# EAGLE design BrushlessDCMotorController (EAGLE 6.5.0)
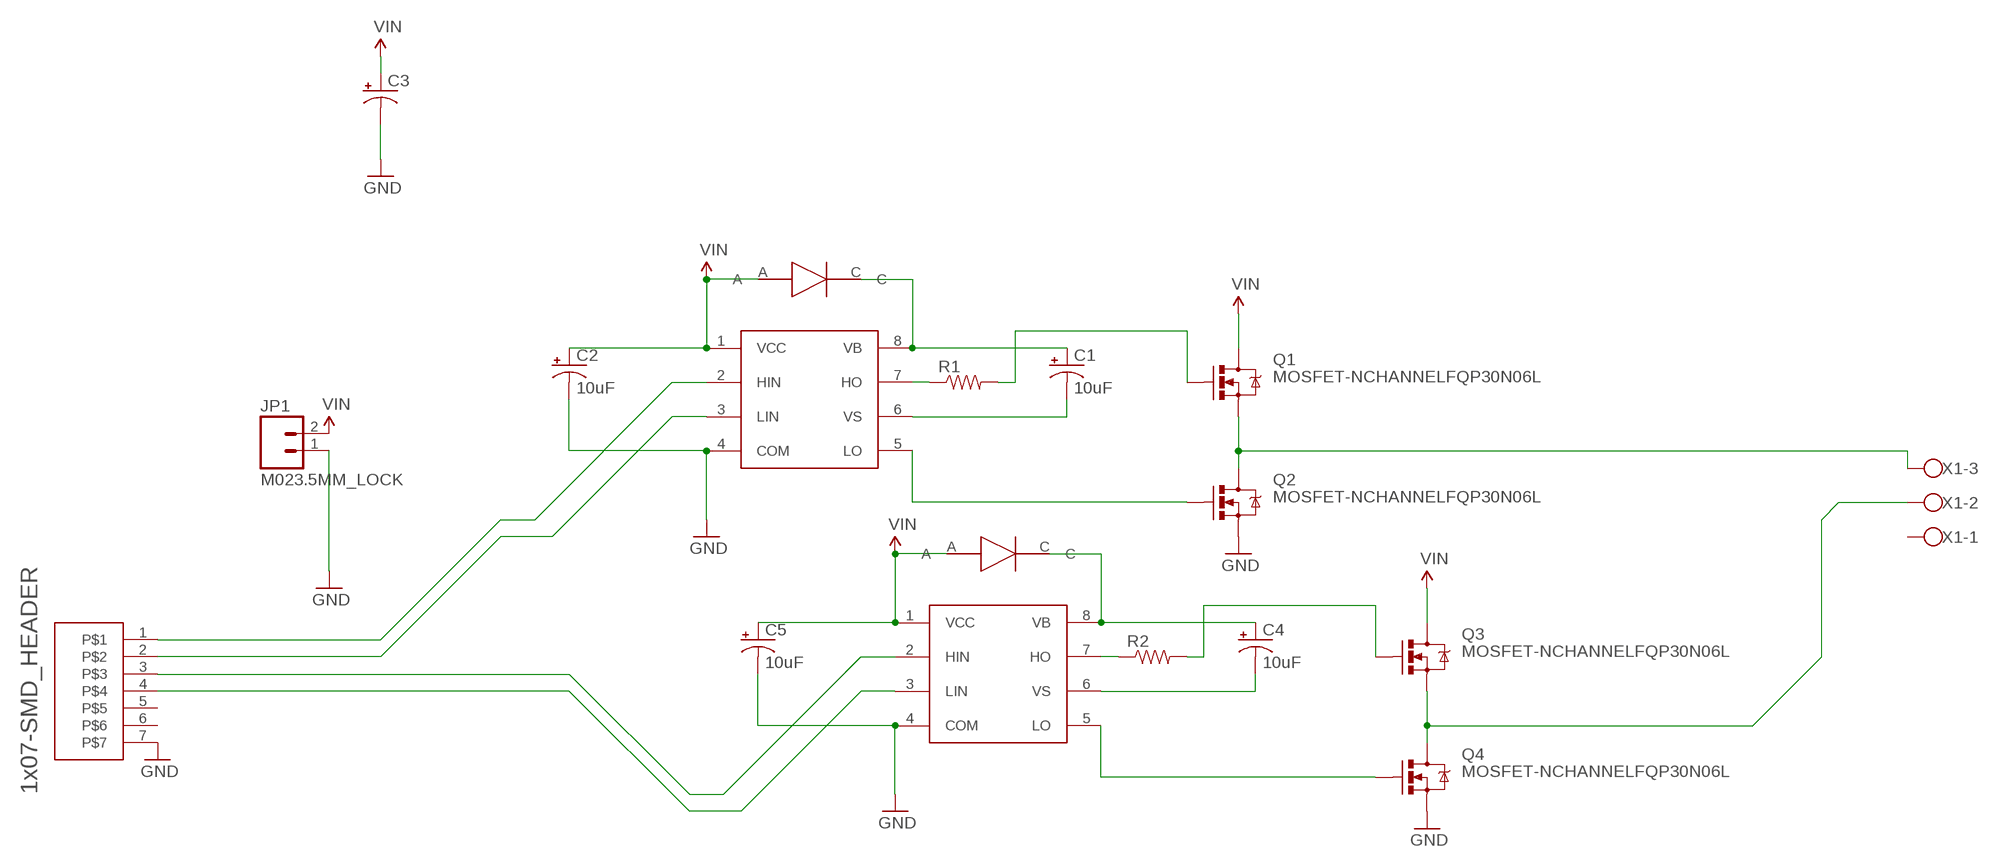
[diagram p0: schematic, sheet 1]

## Parts
C1  10uF  10UF-16V-10%(TANT)  [EIA3216]
C2  10uF  10UF-16V-10%(TANT)  [EIA3216]
C3  CAP_POLD  [PANASONIC_D]
C4  10uF  10UF-16V-10%(TANT)  [EIA3216]
C5  10uF  10UF-16V-10%(TANT)  [EIA3216]
JP1  M023.5MM_LOCK  [SCREWTERMINAL-3.5MM-2_LOCK]
Q1  MOSFET-NCHANNELFQP30N06L  [TO220V]
Q2  MOSFET-NCHANNELFQP30N06L  [TO220V]
Q3  MOSFET-NCHANNELFQP30N06L  [TO220V]
Q4  MOSFET-NCHANNELFQP30N06L  [TO220V]
R1  RESISTOR0805-RES  [0805]
R2  RESISTOR0805-RES  [0805]
U$1  IR2101  [SO08]
U$2  DFLS1150  [2SMD_FLAT_LEAD]
U$3  1X07-SMD_HEADER  [1X07-SMD_HEADER]
U$4  IR2101  [SO08]
U$5  DFLS1150  [2SMD_FLAT_LEAD]
X1  W239-103  [W239-103]

## Nets
GND: C2.C(-) C3.- C5.C(-) JP1.1 Q2.3(S) Q4.3(S) U$1.4(COM) U$3.7 U$4.4(COM)
N$1: C1.A(+) U$1.8(VB) U$2.C
N$2: C1.C(-) U$1.6(VS)
N$3: Q2.1(G) U$1.5(LO)
N$4: U$1.2(HIN) U$3.1
N$5: R1.1 U$1.7(HO)
N$6: Q1.1(G) R1.2
N$7: Q1.3(S) Q2.2(D) X1.3
N$8: U$1.3(LIN) U$3.2
N$9: C4.A(+) U$4.8(VB) U$5.C
N$10: C4.C(-) U$4.6(VS)
N$11: R2.1 U$4.7(HO)
N$12: Q3.1(G) R2.2
N$13: Q3.3(S) Q4.2(D) X1.2
N$14: Q4.1(G) U$4.5(LO)
N$15: U$3.3 U$4.2(HIN)
N$16: U$3.4 U$4.3(LIN)
VIN: C2.A(+) C3.+ C5.A(+) JP1.2 Q1.2(D) Q3.2(D) U$1.1(VCC) U$2.A U$4.1(VCC) U$5.A
Unconnected: U$3.5 U$3.6 X1.1

## Library data of the parts
C1 C2 C4 C5 = SparkFun-Capacitors:10UF-16V-10%(TANT): CAP-00811 1206/EIA-3216 Tantalum capacitor; PROD_ID: CAP-00811
C3 = SparkFun-Capacitors:CAP_POL: Capacitor Polarized These are standard SMD and PTH capacitors. Normally 10uF, 47uF, and 100uF in electrolytic and tantalum varieties. Always verify the external diameter of the through hole cap, it varies with capacity, voltage, and manufacturer. The EIA devices should be standard.
JP1 = SparkFun-Connectors:M02: Standard 2-pin 0.1" header. Use with - straight break away headers ( PRT-00116) - right angle break away headers (PRT-00553) - swiss pins (PRT-00743) - machine pins (PRT-00117) - female headers (PRT-00115) Molex polarized connector foot print use with: PRT-08233 with associated crimp pins and housings. 2.54_SCREWTERM for use with PRT-10571. 3.5mm Screw Terminal footprints for PRT-08084 5mm Screw Terminal footprints for use with PRT-08433
Q1-Q4 = SparkFun-DiscreteSemi:MOSFET-NCHANNEL: Common NMOSFET Parts MFG P/N Store ID Prod ID FDD8780 TRANS-09984 SI7820DN TRANS-11055 FDS6630A IC-08089 2N7002PW TRANS-11151 FQP30N06L COM-10213 TRANS-10060 BSS123LT1G TRANS-08345 BSS138 TRANS-00830 BS170 2N7000; PROD_ID: TRANS-10060
R1 R2 = SparkFun-Passives:RESISTOR: Resistor Basic schematic elements and footprints for 0603, 1206, and PTH resistors.
U$1 U$4 = hmcfabstudio:IR2101
U$2 U$5 = hmcfabstudio:DFLS1150: Digkey: DFLS1150DICT-ND Datasheet <http://www.diodes.com/datasheets/ds30593.pdf> 1.0A HIGH VOLTAGE SCHOTTKY BARRIER RECTIFIER (diode) V_f = 0.82 [v] V_reverse = 150 [v]
U$3 = hmcfabstudio:1X07-SMD_HEADER
X1 = con-wago-500:W239-103: WAGO SCREW CLAMP; MPN: 239-103; OC_FARNELL: unknown; OC_NEWARK: 33M7170

## Board
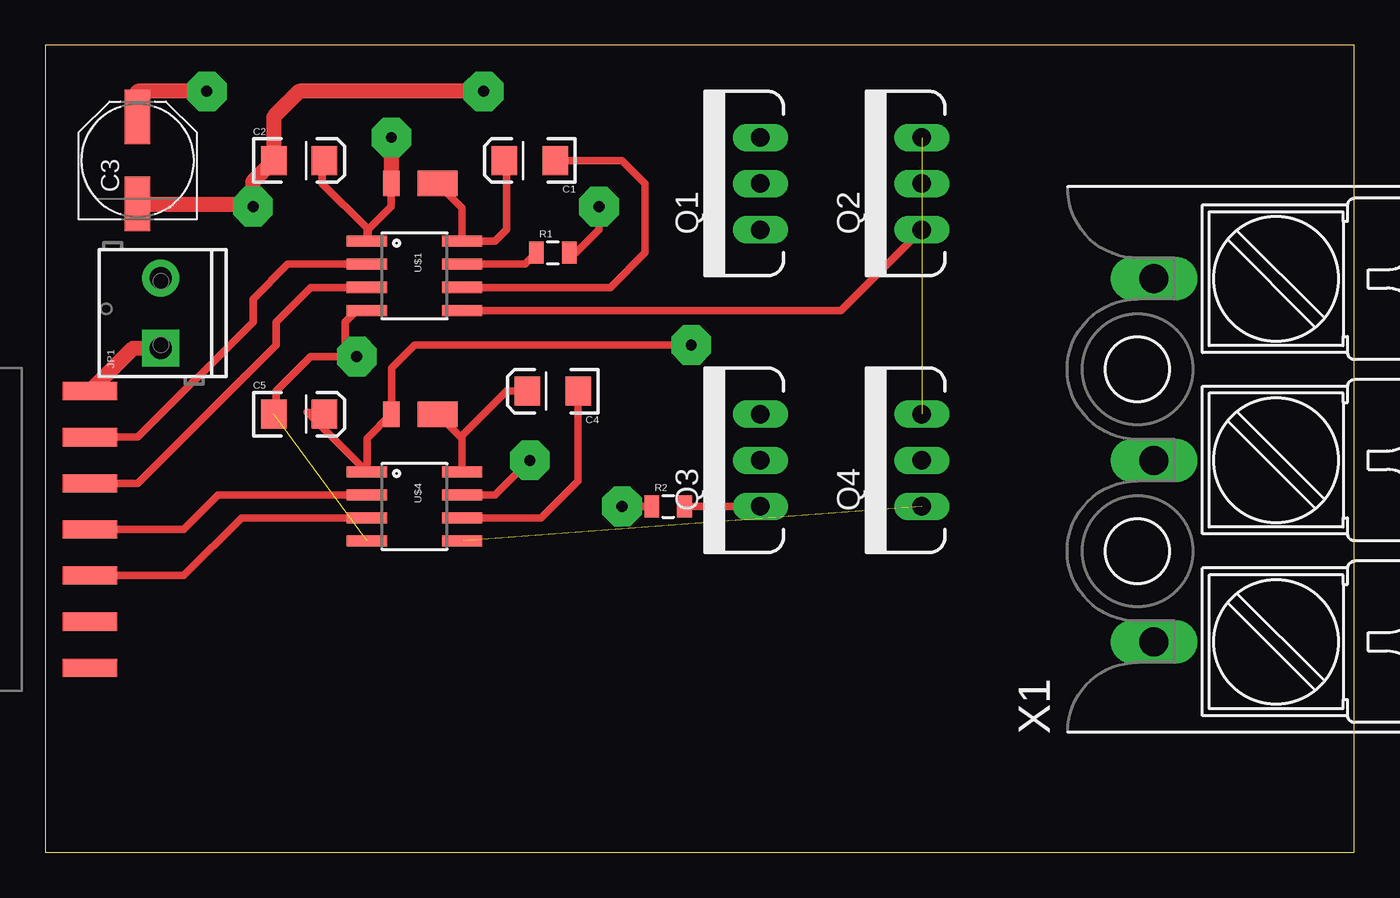
[diagram p1: board, top side]
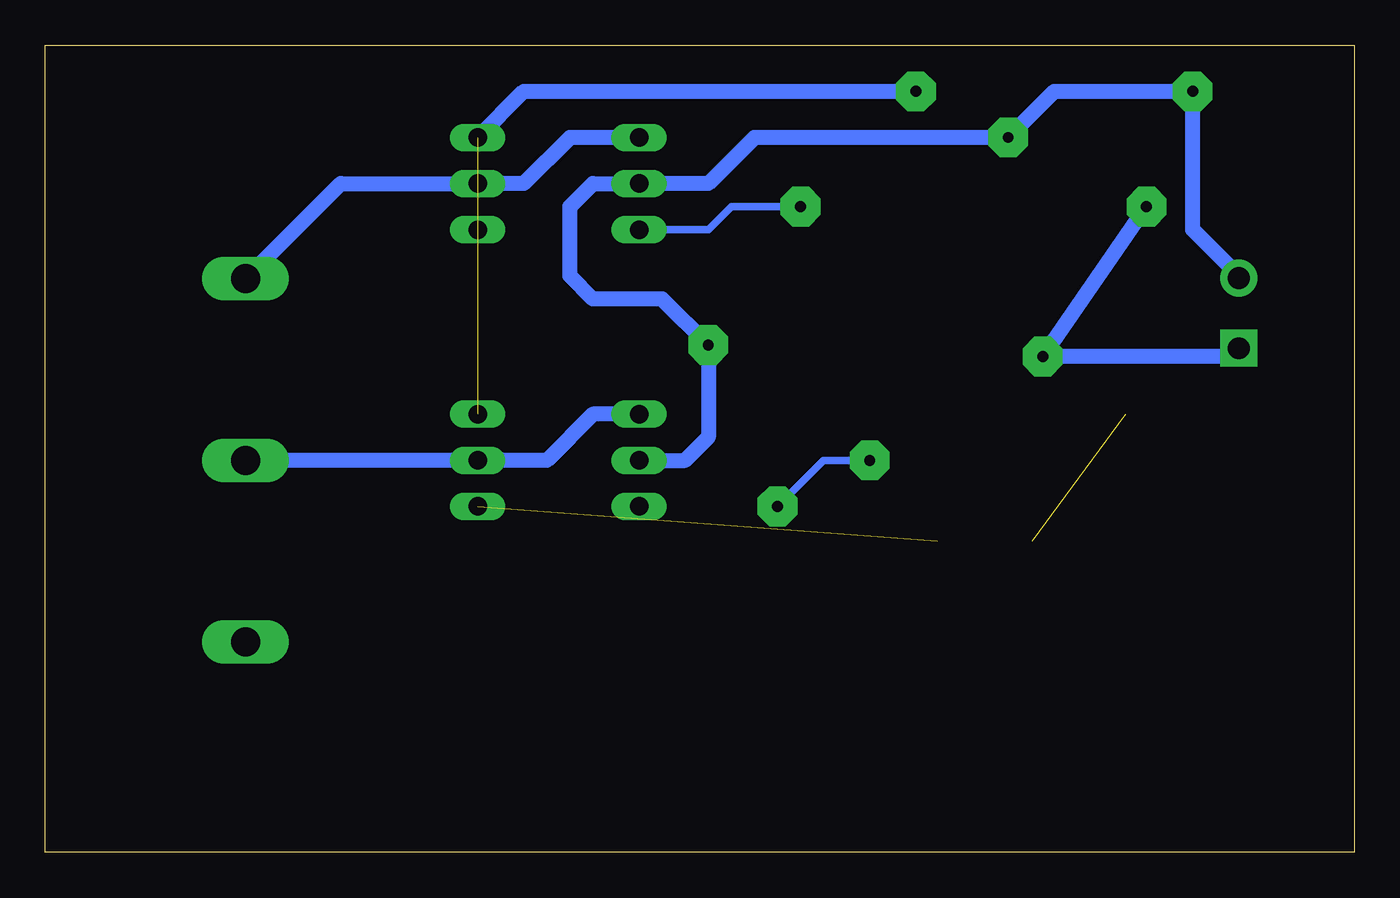
[diagram p2: board, bottom side, seen from below]

Size 72.06 x 44.44 mm. Coordinates in mm from the lower left corner, seen from the top.
Outline: 0,0 72.06,0 72.06,44.44 0,44.44 0,0
Copper layers (1*16): Top 0.035mm / dielectric 1.5mm / Bottom 0.035mm
Design rules "default": minimum track width 10mil, minimum drill 24mil, track to track 8mil, track to pad 8mil, pad to pad 8mil, via to via 8mil, smd to smd 8mil, copper to edge 40mil, drill to drill 8mil, minimum pad ring 10mil, minimum via ring 8mil, stop-mask expansion 4mil, vias tented up to drill 0mil, thermal gap 10mil

### Footprints (pad centres in the part's own frame; a part is rotated, then mirrored left to right if it is on the bottom)
EIA3216 = smd 1.4 x 1.6: A 1.4,0; C -1.4,0
PANASONIC_D = smd 3 x 1.4: + 2.4,0; - -2.4,0
SCREWTERMINAL-3.5MM-2_LOCK = drill 1.2 pad 2.032 square: 1 -0.178,0 | drill 1.2 pad 2.032: 2 3.678,0
TO220V = drill 1.016 long: 1 -2.54,0; 2 0,0; 3 2.54,0
0805 = smd 0.8 x 1.2: 1 -0.9,0; 2 0.9,0
SO08 = smd 0.61 x 2.21: 1 -1.905,-2.616; 2 -0.635,-2.616; 3 0.635,-2.616; 4 1.905,-2.616; 5 1.905,2.616; 6 0.635,2.616; 7 -0.635,2.616; 8 -1.905,2.616
2SMD_FLAT_LEAD = smd 0.9 x 1.4: A 2.55,0 | smd 2.2 x 1.4: C 0,0
1X07-SMD_HEADER = smd 1 x 3: 1 -6.35,5; 2 -3.81,5; 3 -1.27,5; 4 1.27,5; 5 3.81,5; 6 6.35,5; 7 -8.89,5
W239-103 = drill 1.6 long: 1 -10,5; 2 0,5; 3 10,5

### Placement (x,y rotation side)
C1  26.67,38.1 180 top
C2  13.97,38.1 0 top
C3  5.08,38.1 90 top
C4  27.94,25.4 180 top
C5  13.97,24.13 0 top
JP1  6.35,27.94 90 top
Q1  39.37,36.83 90 top
Q2  48.26,36.83 90 top
Q3  39.37,21.59 90 top
Q4  48.26,21.59 90 top
R1  27.94,33.02 0 top
R2  34.29,19.05 0 top
U$1  20.32,31.75 270 top
U$2  21.59,36.83 180 top
U$3  -2.54,16.51 270 top
U$4  20.32,19.05 270 top
U$5  21.59,24.13 180 top
X1  66.04,21.59 90 top

### Tracks (layer width: path | path; a pad name or v marks a point on that pad's centre or on a via)
GND  (via drill 0.6 pad 2.18)  (2 unrouted)
  Top 0.406: U$1.4 17.14,29.84 16.51,29.21 16.51,27.94 v17.14,27.3 14.61,27.3 12.7,25.4 12.7,24.26 C5.C
  Top 0.813: v24.13,41.91 13.97,41.91 12.57,40.51 C2.C 11.43,36.96 v11.43,35.56 11.29,35.7 C3.- | U$3.7 4.82,27.76 JP1.1
  Bottom 0.813: Q2.3 45.72,41.91 v24.13,41.91 | v11.43,35.56 v17.14,27.3 6.81,27.3 JP1.1
N$1
  Top 0.406: C1.A 25.4,37.97 25.4,34.29 24.77,33.66 U$1.8 22.94,35.48 U$2.C
N$2
  Top 0.406: U$1.6 31.11,31.11 33.02,33.02 33.02,36.83 31.75,38.1 C1.C
N$3
  Top 0.406: Q2.1 43.81,29.84 U$1.5
N$4
  Top 0.406: U$3.1 5.08,22.86 11.43,29.21 11.43,30.48 13.34,32.38 U$1.2
N$5
  Top 0.406: R1.1 26.41,32.38 U$1.7
N$6  (via drill 0.6 pad 2.18)
  Top 0.406: v30.48,35.56 30.48,34.29 29.21,33.02 R1.2
  Bottom 0.406: Q1.1 35.56,34.29 34.29,35.56 v30.48,35.56
N$7
  Bottom 0.813: Q1.3 43.18,39.37 45.72,36.83 Q2.2 55.8,36.83 X1.3
N$8
  Top 0.406: U$3.2 5.08,20.32 12.7,27.94 12.7,29.21 14.61,31.11 U$1.3
N$9
  Top 0.406: U$4.8 22.94,22.78 22.86,22.86 | 22.86,22.86 U$5.C | C4.A 25.4,25.4 22.86,22.86
N$10
  Top 0.406: C4.C 29.34,20.45 27.3,18.41 U$4.6
N$11  (via drill 0.6 pad 2.18)
  Top 0.406: R2.1 v31.75,19.05 | v26.67,21.59 24.77,19.68 U$4.7
  Bottom 0.406: v31.75,19.05 29.21,21.59 v26.67,21.59
N$12
  Top 0.406: R2.2 Q3.1
N$13
  Bottom 0.813: Q3.3 41.91,24.13 44.45,21.59 Q4.2 X1.2
N$14  (1 unrouted)
N$15
  Top 0.406: U$4.2 9.53,19.68 7.62,17.78 U$3.3
N$16
  Top 0.406: U$3.4 7.62,15.24 10.79,18.41 U$4.3
VIN  (via drill 0.6 pad 2.18)
  Top 0.406: U$2.A 19.04,35.55 17.78,34.29 17.78,33.73 U$1.1 17.7,34.37 15.24,36.83 15.24,37.97 C2.A | C5.A 14.4,24.26 U$4.1 17.7,22.79 U$5.A 19.05,26.67 20.32,27.94 v35.56,27.94
  Top 0.813: v8.89,41.91 5.08,41.91 C3.+ | v19.05,39.37 v19.04,39.36 U$2.A
  Bottom 0.813: JP1.2 6.35,31.75 8.89,34.29 v8.89,41.91 16.51,41.91 v19.05,39.37 33.02,39.37 35.56,36.83 Q1.2 41.91,36.83 43.18,35.56 43.18,31.75 41.91,30.48 38.1,30.48 v35.56,27.94 35.56,22.86 36.83,21.59 Q3.2